# EAGLE schematic Adapter (EAGLE 6.4)

## Sheet 1 of 8
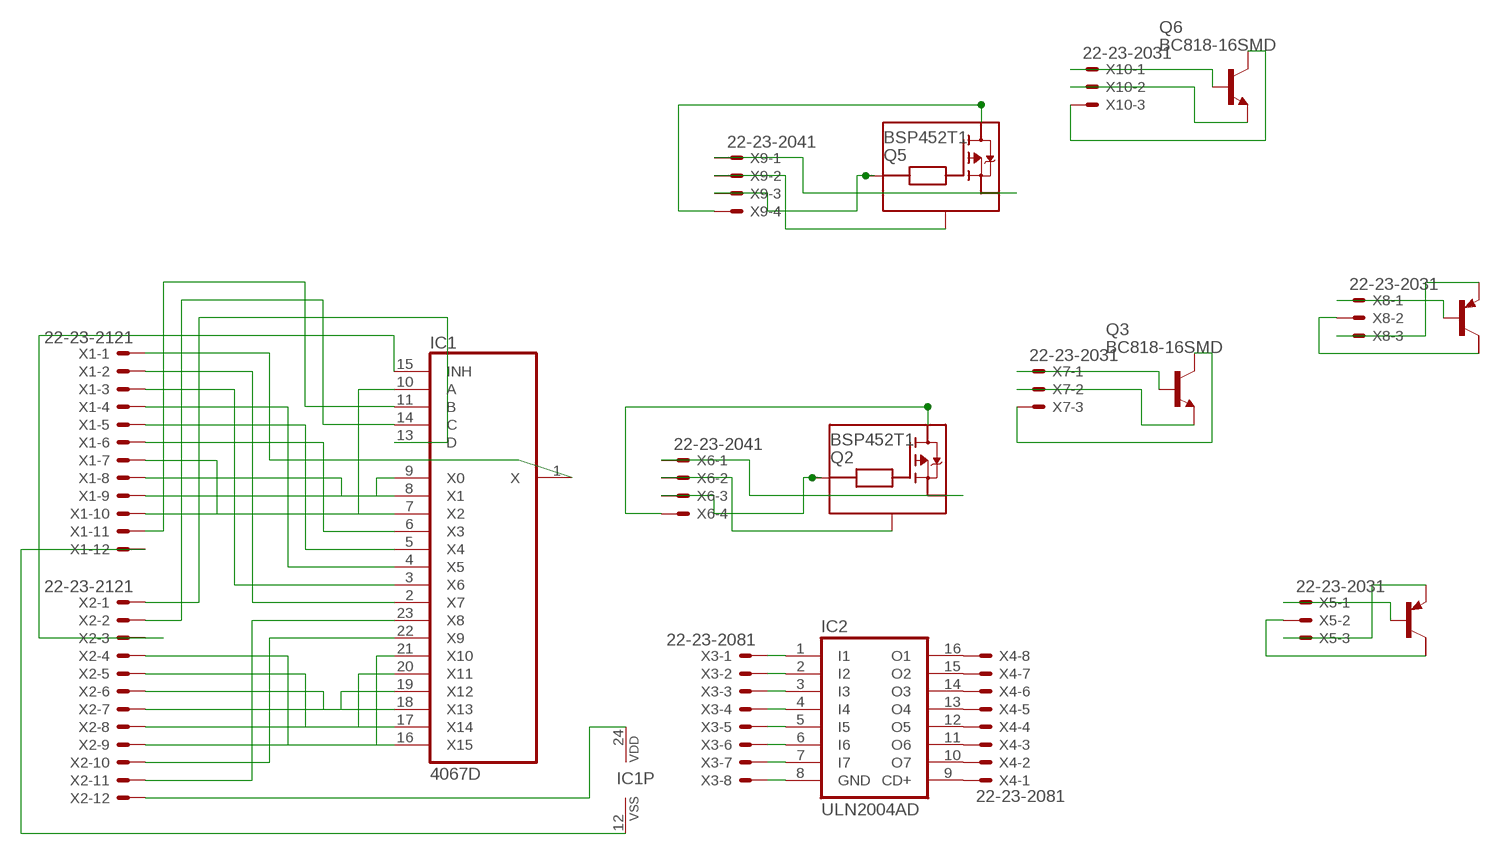
[diagram p0: schematic, sheet 1]

### Parts
IC1  4067D  [SO24W]
IC2  ULN2004AD  [SO16]
Q1  BCP53T1  [SOT223]
Q2  BSP452T1  [SOT223]
Q3  BC818-16SMD  [SOT23-BEC]
Q4  BCP53T1  [SOT223]
Q5  BSP452T1  [SOT223]
Q6  BC818-16SMD  [SOT23-BEC]
X1  22-23-2121  [22-23-2121]
X2  22-23-2121  [22-23-2121]
X3  22-23-2081  [22-23-2081]
X4  22-23-2081  [22-23-2081]
X5  22-23-2031  [22-23-2031]
X6  22-23-2041  [22-23-2041]
X7  22-23-2031  [22-23-2031]
X8  22-23-2031  [22-23-2031]
X9  22-23-2041  [22-23-2041]
X10  22-23-2031  [22-23-2031]

### Nets
N$1: IC1.2(X7) X1.2
N$2: IC1.1(X) X1.1
N$3: IC1.3(X6) X1.3
N$4: IC1.4(X5) X1.4
N$5: IC1.5(X4) X1.5
N$6: IC1.6(X3) X1.6
N$7: IC1.7(X2) X1.7
N$8: IC1.8(X1) X1.8
N$9: IC1.9(X0) X1.9
N$10: IC1.10(A) X1.10
N$11: IC1.11(B) X1.11
N$12: IC1.16(X15) X2.4
N$13: IC1.17(X14) X2.5
N$14: IC1.18(X13) X2.6
N$15: IC1.19(X12) X2.7
N$16: IC1.20(X11) X2.8
N$17: IC1.21(X10) X2.9
N$18: IC1.22(X9) X2.10
N$19: IC1.23(X8) X2.11
N$20: IC1.12(VSS) X1.12
N$21: IC1.24(VDD) X2.12
N$22: IC1.15(INH) X2.3
N$23: IC1.14(C) X2.2
N$24: IC1.13(D) X2.1
N$25: IC2.1(I1) X3.1
N$26: IC2.2(I2) X3.2
N$27: IC2.3(I3) X3.3
N$28: IC2.4(I4) X3.4
N$29: IC2.5(I5) X3.5
N$30: IC2.6(I6) X3.6
N$31: IC2.7(I7) X3.7
N$32: IC2.8(GND) X3.8
N$33: IC2.9(CD+) X4.1
N$34: IC2.10(O7) X4.2
N$35: IC2.11(O6) X4.3
N$36: IC2.12(O5) X4.4
N$37: IC2.13(O4) X4.5
N$38: IC2.14(O3) X4.6
N$39: IC2.15(O2) X4.7
N$40: IC2.16(O1) X4.8
N$41: Q1.1(B) X5.1
N$42: Q1.3(E) X5.3
N$43: Q1.2(C) X5.2
N$44: Q2.1(OUT) X6.1
N$45: Q2.2(GND) X6.2
N$46: Q2.3(IN) X6.3
N$47: Q2.4(V+) X6.4
N$48: Q3.B X7.1
N$49: Q3.E X7.2
N$50: Q3.C X7.3
N$51: Q4.1(B) X8.1
N$52: Q4.2(C) X8.2
N$53: Q4.3(E) X8.3
N$54: Q5.1(OUT) X9.1
N$55: Q5.2(GND) X9.2
N$56: Q5.3(IN) X9.3
N$57: Q5.4(V+) X9.4
N$58: Q6.B X10.1
N$59: Q6.E X10.2
N$60: Q6.C X10.3
Unconnected: Q1.4(C/) Q4.4(C/)

## Sheet 2 of 8
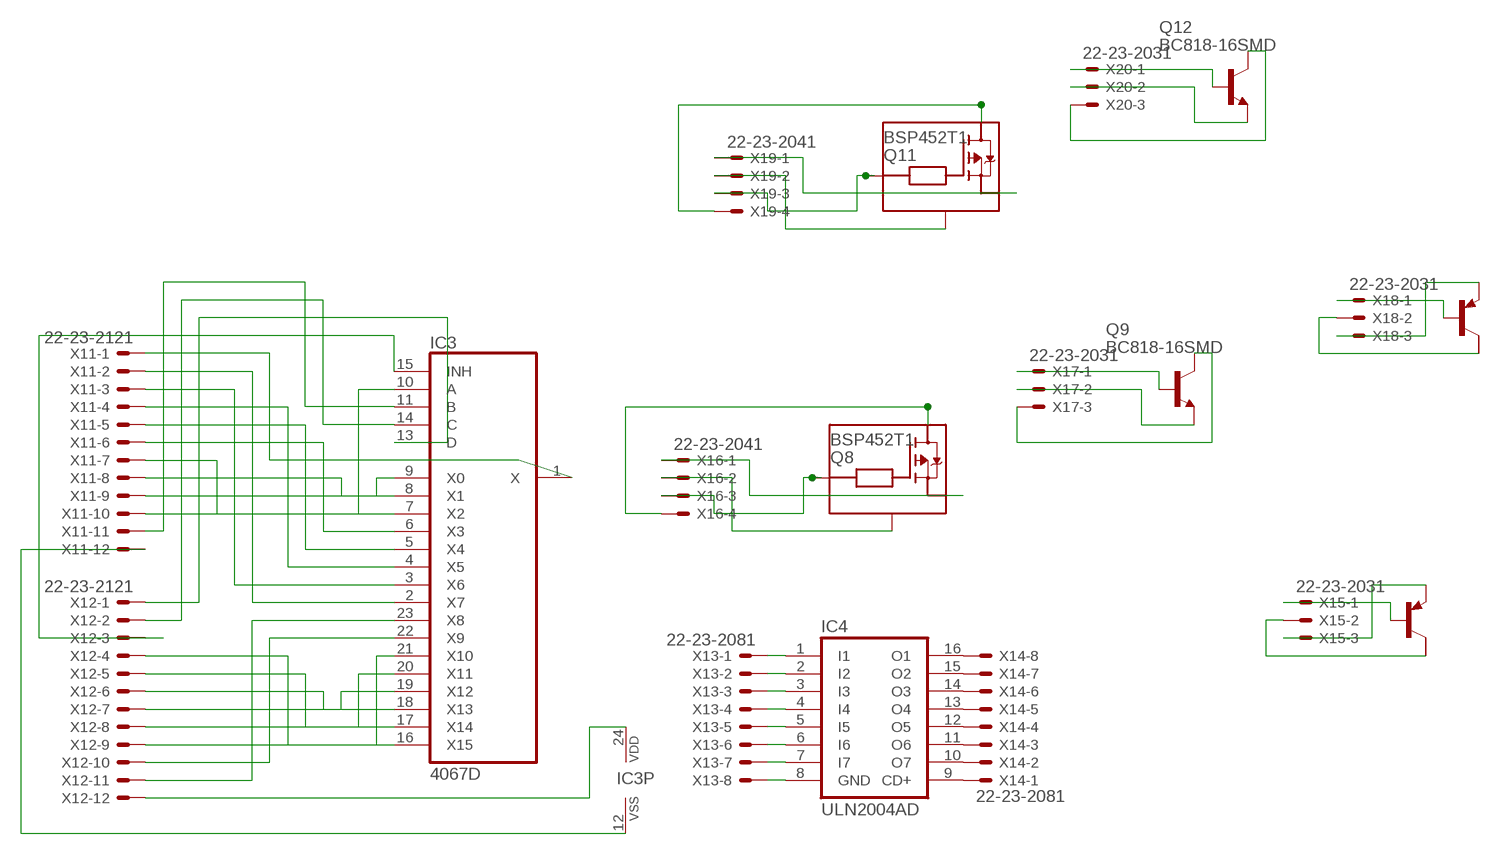
[diagram p1: schematic, sheet 2]

### Parts
IC3  4067D  [SO24W]
IC4  ULN2004AD  [SO16]
Q7  BCP53T1  [SOT223]
Q8  BSP452T1  [SOT223]
Q9  BC818-16SMD  [SOT23-BEC]
Q10  BCP53T1  [SOT223]
Q11  BSP452T1  [SOT223]
Q12  BC818-16SMD  [SOT23-BEC]
X11  22-23-2121  [22-23-2121]
X12  22-23-2121  [22-23-2121]
X13  22-23-2081  [22-23-2081]
X14  22-23-2081  [22-23-2081]
X15  22-23-2031  [22-23-2031]
X16  22-23-2041  [22-23-2041]
X17  22-23-2031  [22-23-2031]
X18  22-23-2031  [22-23-2031]
X19  22-23-2041  [22-23-2041]
X20  22-23-2031  [22-23-2031]

### Nets
N$63: IC3.2(X7) X11.2
N$64: IC3.1(X) X11.1
N$65: IC3.3(X6) X11.3
N$66: IC3.4(X5) X11.4
N$67: IC3.5(X4) X11.5
N$68: IC3.6(X3) X11.6
N$69: IC3.7(X2) X11.7
N$70: IC3.8(X1) X11.8
N$71: IC3.9(X0) X11.9
N$72: IC3.10(A) X11.10
N$73: IC3.11(B) X11.11
N$74: IC3.16(X15) X12.4
N$75: IC3.17(X14) X12.5
N$76: IC3.18(X13) X12.6
N$77: IC3.19(X12) X12.7
N$78: IC3.20(X11) X12.8
N$79: IC3.21(X10) X12.9
N$80: IC3.22(X9) X12.10
N$81: IC3.23(X8) X12.11
N$82: IC3.12(VSS) X11.12
N$83: IC3.24(VDD) X12.12
N$84: IC3.15(INH) X12.3
N$85: IC3.14(C) X12.2
N$86: IC3.13(D) X12.1
N$87: IC4.1(I1) X13.1
N$88: IC4.2(I2) X13.2
N$89: IC4.3(I3) X13.3
N$90: IC4.4(I4) X13.4
N$91: IC4.5(I5) X13.5
N$92: IC4.6(I6) X13.6
N$93: IC4.7(I7) X13.7
N$94: IC4.8(GND) X13.8
N$95: IC4.9(CD+) X14.1
N$96: IC4.10(O7) X14.2
N$97: IC4.11(O6) X14.3
N$98: IC4.12(O5) X14.4
N$99: IC4.13(O4) X14.5
N$100: IC4.14(O3) X14.6
N$101: IC4.15(O2) X14.7
N$102: IC4.16(O1) X14.8
N$103: Q7.1(B) X15.1
N$104: Q7.2(C) X15.2
N$105: Q7.3(E) X15.3
N$106: Q8.1(OUT) X16.1
N$107: Q8.2(GND) X16.2
N$108: Q8.3(IN) X16.3
N$109: Q8.4(V+) X16.4
N$110: Q9.B X17.1
N$111: Q9.E X17.2
N$112: Q9.C X17.3
N$113: Q10.1(B) X18.1
N$114: Q10.2(C) X18.2
N$115: Q10.3(E) X18.3
N$116: Q11.1(OUT) X19.1
N$117: Q11.2(GND) X19.2
N$118: Q11.3(IN) X19.3
N$119: Q11.4(V+) X19.4
N$120: Q12.B X20.1
N$121: Q12.E X20.2
N$122: Q12.C X20.3
Unconnected: Q7.4(C/) Q10.4(C/)

## Sheet 3 of 8
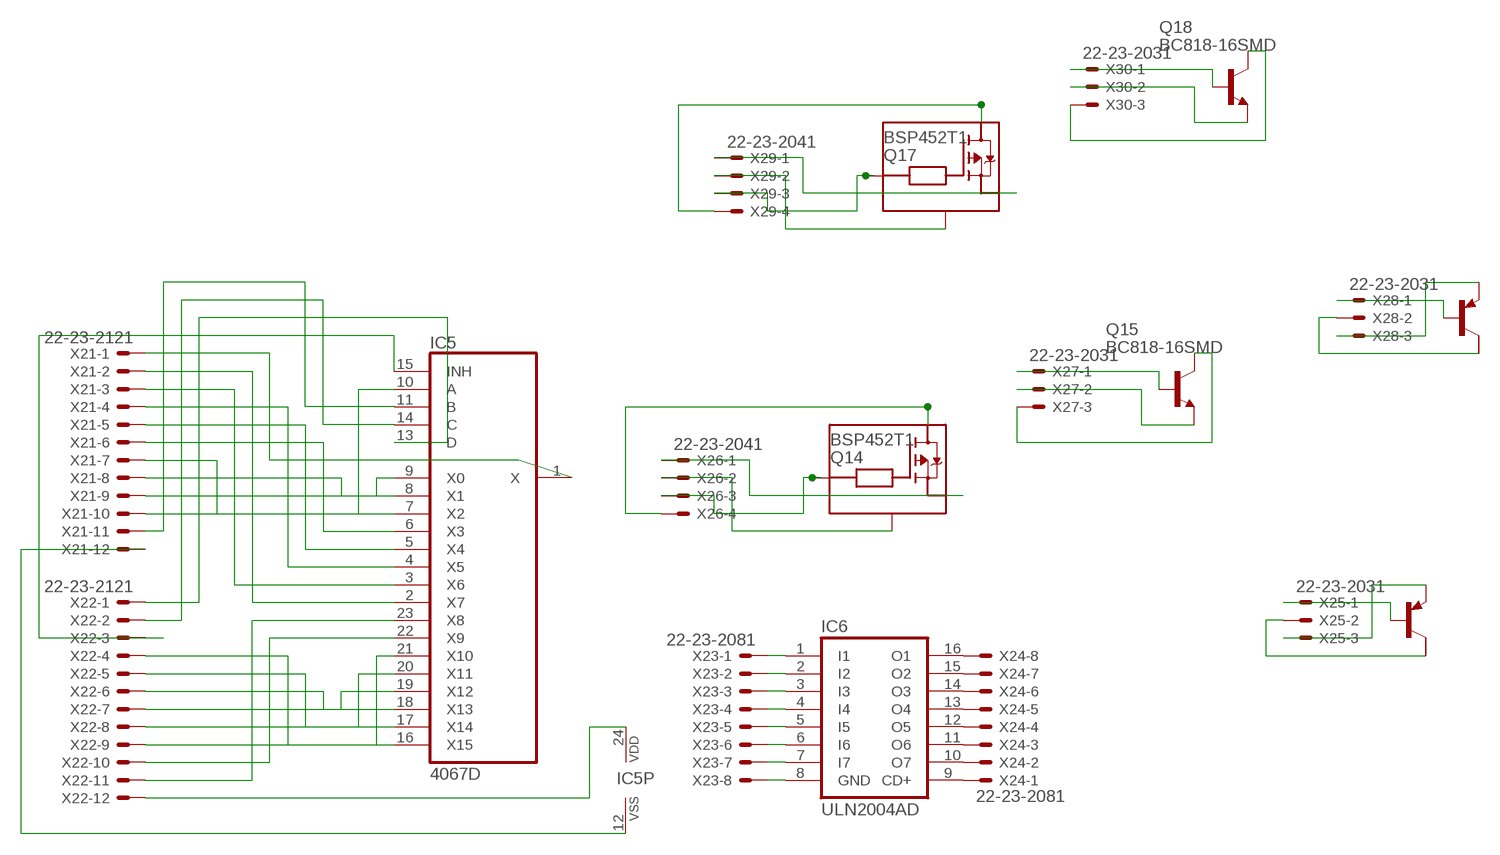
[diagram p2: schematic, sheet 3]

### Parts
IC5  4067D  [SO24W]
IC6  ULN2004AD  [SO16]
Q13  BCP53T1  [SOT223]
Q14  BSP452T1  [SOT223]
Q15  BC818-16SMD  [SOT23-BEC]
Q16  BCP53T1  [SOT223]
Q17  BSP452T1  [SOT223]
Q18  BC818-16SMD  [SOT23-BEC]
X21  22-23-2121  [22-23-2121]
X22  22-23-2121  [22-23-2121]
X23  22-23-2081  [22-23-2081]
X24  22-23-2081  [22-23-2081]
X25  22-23-2031  [22-23-2031]
X26  22-23-2041  [22-23-2041]
X27  22-23-2031  [22-23-2031]
X28  22-23-2031  [22-23-2031]
X29  22-23-2041  [22-23-2041]
X30  22-23-2031  [22-23-2031]

### Nets
N$125: IC5.2(X7) X21.2
N$126: IC5.1(X) X21.1
N$127: IC5.3(X6) X21.3
N$128: IC5.4(X5) X21.4
N$129: IC5.5(X4) X21.5
N$130: IC5.6(X3) X21.6
N$131: IC5.7(X2) X21.7
N$132: IC5.8(X1) X21.8
N$133: IC5.9(X0) X21.9
N$134: IC5.10(A) X21.10
N$135: IC5.11(B) X21.11
N$136: IC5.16(X15) X22.4
N$137: IC5.17(X14) X22.5
N$138: IC5.18(X13) X22.6
N$139: IC5.19(X12) X22.7
N$140: IC5.20(X11) X22.8
N$141: IC5.21(X10) X22.9
N$142: IC5.22(X9) X22.10
N$143: IC5.23(X8) X22.11
N$144: IC5.12(VSS) X21.12
N$145: IC5.24(VDD) X22.12
N$146: IC5.15(INH) X22.3
N$147: IC5.14(C) X22.2
N$148: IC5.13(D) X22.1
N$149: IC6.1(I1) X23.1
N$150: IC6.2(I2) X23.2
N$151: IC6.3(I3) X23.3
N$152: IC6.4(I4) X23.4
N$153: IC6.5(I5) X23.5
N$154: IC6.6(I6) X23.6
N$155: IC6.7(I7) X23.7
N$156: IC6.8(GND) X23.8
N$157: IC6.9(CD+) X24.1
N$158: IC6.10(O7) X24.2
N$159: IC6.11(O6) X24.3
N$160: IC6.12(O5) X24.4
N$161: IC6.13(O4) X24.5
N$162: IC6.14(O3) X24.6
N$163: IC6.15(O2) X24.7
N$164: IC6.16(O1) X24.8
N$165: Q13.1(B) X25.1
N$166: Q13.2(C) X25.2
N$167: Q13.3(E) X25.3
N$168: Q14.1(OUT) X26.1
N$169: Q14.2(GND) X26.2
N$170: Q14.3(IN) X26.3
N$171: Q14.4(V+) X26.4
N$172: Q15.B X27.1
N$173: Q15.E X27.2
N$174: Q15.C X27.3
N$175: Q16.1(B) X28.1
N$176: Q16.2(C) X28.2
N$177: Q16.3(E) X28.3
N$178: Q17.1(OUT) X29.1
N$179: Q17.2(GND) X29.2
N$180: Q17.3(IN) X29.3
N$181: Q17.4(V+) X29.4
N$182: Q18.B X30.1
N$183: Q18.E X30.2
N$184: Q18.C X30.3
Unconnected: Q13.4(C/) Q16.4(C/)

## Sheet 4 of 8
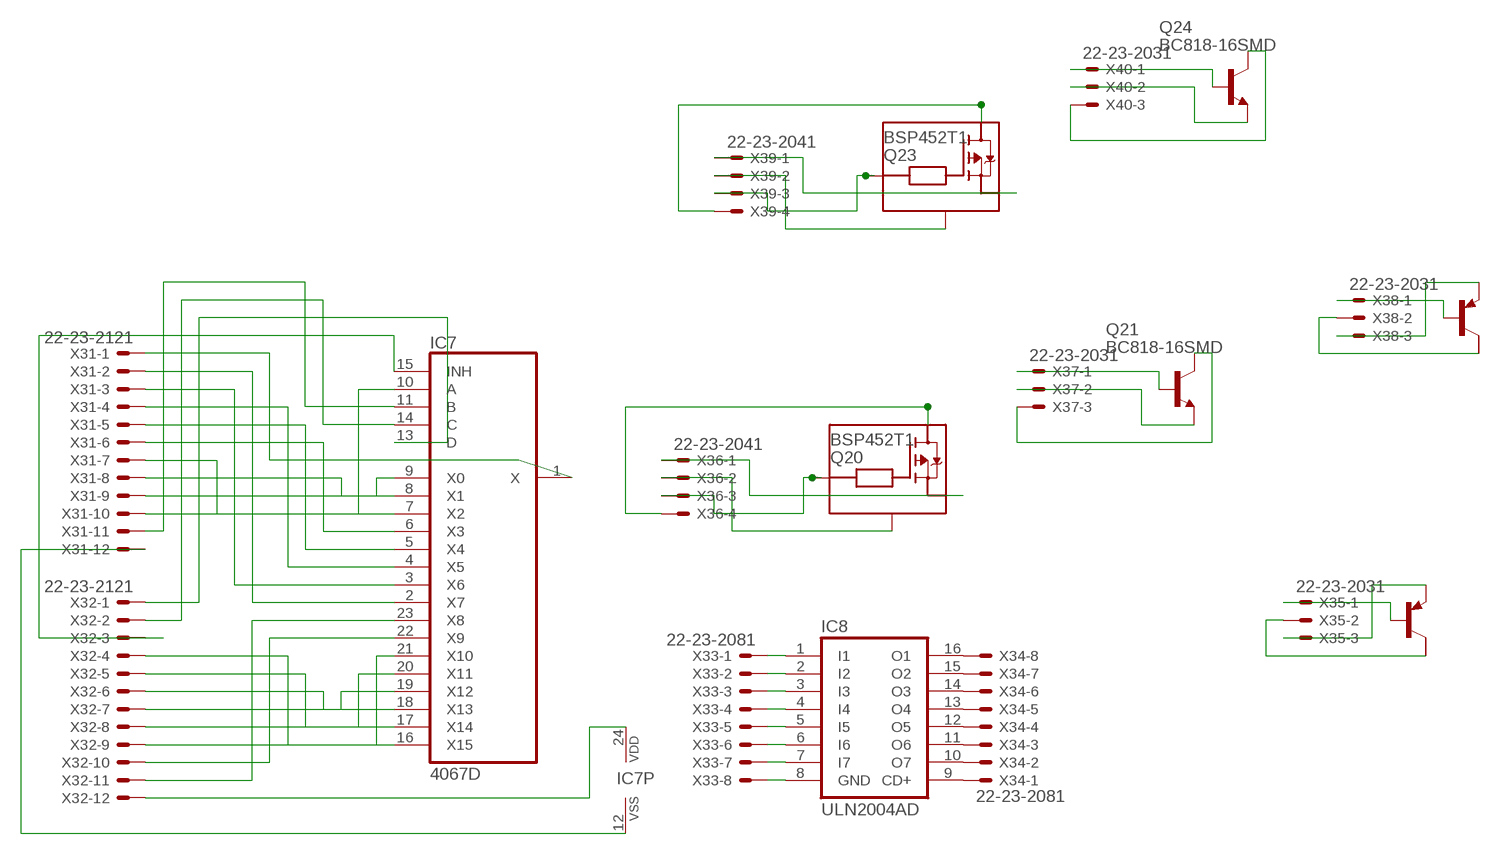
[diagram p3: schematic, sheet 4]

### Parts
IC7  4067D  [SO24W]
IC8  ULN2004AD  [SO16]
Q19  BCP53T1  [SOT223]
Q20  BSP452T1  [SOT223]
Q21  BC818-16SMD  [SOT23-BEC]
Q22  BCP53T1  [SOT223]
Q23  BSP452T1  [SOT223]
Q24  BC818-16SMD  [SOT23-BEC]
X31  22-23-2121  [22-23-2121]
X32  22-23-2121  [22-23-2121]
X33  22-23-2081  [22-23-2081]
X34  22-23-2081  [22-23-2081]
X35  22-23-2031  [22-23-2031]
X36  22-23-2041  [22-23-2041]
X37  22-23-2031  [22-23-2031]
X38  22-23-2031  [22-23-2031]
X39  22-23-2041  [22-23-2041]
X40  22-23-2031  [22-23-2031]

### Nets
N$185: IC7.2(X7) X31.2
N$186: IC7.1(X) X31.1
N$187: IC7.3(X6) X31.3
N$188: IC7.4(X5) X31.4
N$189: IC7.5(X4) X31.5
N$190: IC7.6(X3) X31.6
N$191: IC7.7(X2) X31.7
N$192: IC7.8(X1) X31.8
N$193: IC7.9(X0) X31.9
N$194: IC7.10(A) X31.10
N$195: IC7.11(B) X31.11
N$196: IC7.16(X15) X32.4
N$197: IC7.17(X14) X32.5
N$198: IC7.18(X13) X32.6
N$199: IC7.19(X12) X32.7
N$200: IC7.20(X11) X32.8
N$201: IC7.21(X10) X32.9
N$202: IC7.22(X9) X32.10
N$203: IC7.23(X8) X32.11
N$204: IC7.12(VSS) X31.12
N$205: IC7.24(VDD) X32.12
N$206: IC7.15(INH) X32.3
N$207: IC7.14(C) X32.2
N$208: IC7.13(D) X32.1
N$209: IC8.1(I1) X33.1
N$210: IC8.2(I2) X33.2
N$211: IC8.3(I3) X33.3
N$212: IC8.4(I4) X33.4
N$213: IC8.5(I5) X33.5
N$214: IC8.6(I6) X33.6
N$215: IC8.7(I7) X33.7
N$216: IC8.8(GND) X33.8
N$217: IC8.9(CD+) X34.1
N$218: IC8.10(O7) X34.2
N$219: IC8.11(O6) X34.3
N$220: IC8.12(O5) X34.4
N$221: IC8.13(O4) X34.5
N$222: IC8.14(O3) X34.6
N$223: IC8.15(O2) X34.7
N$224: IC8.16(O1) X34.8
N$225: Q19.1(B) X35.1
N$226: Q19.2(C) X35.2
N$227: Q19.3(E) X35.3
N$228: Q20.1(OUT) X36.1
N$229: Q20.2(GND) X36.2
N$230: Q20.3(IN) X36.3
N$231: Q20.4(V+) X36.4
N$232: Q21.B X37.1
N$233: Q21.E X37.2
N$234: Q21.C X37.3
N$235: Q22.1(B) X38.1
N$236: Q22.2(C) X38.2
N$237: Q22.3(E) X38.3
N$238: Q23.1(OUT) X39.1
N$239: Q23.2(GND) X39.2
N$240: Q23.3(IN) X39.3
N$241: Q23.4(V+) X39.4
N$242: Q24.B X40.1
N$243: Q24.E X40.2
N$244: Q24.C X40.3
Unconnected: Q19.4(C/) Q22.4(C/)

## Sheet 5 of 8
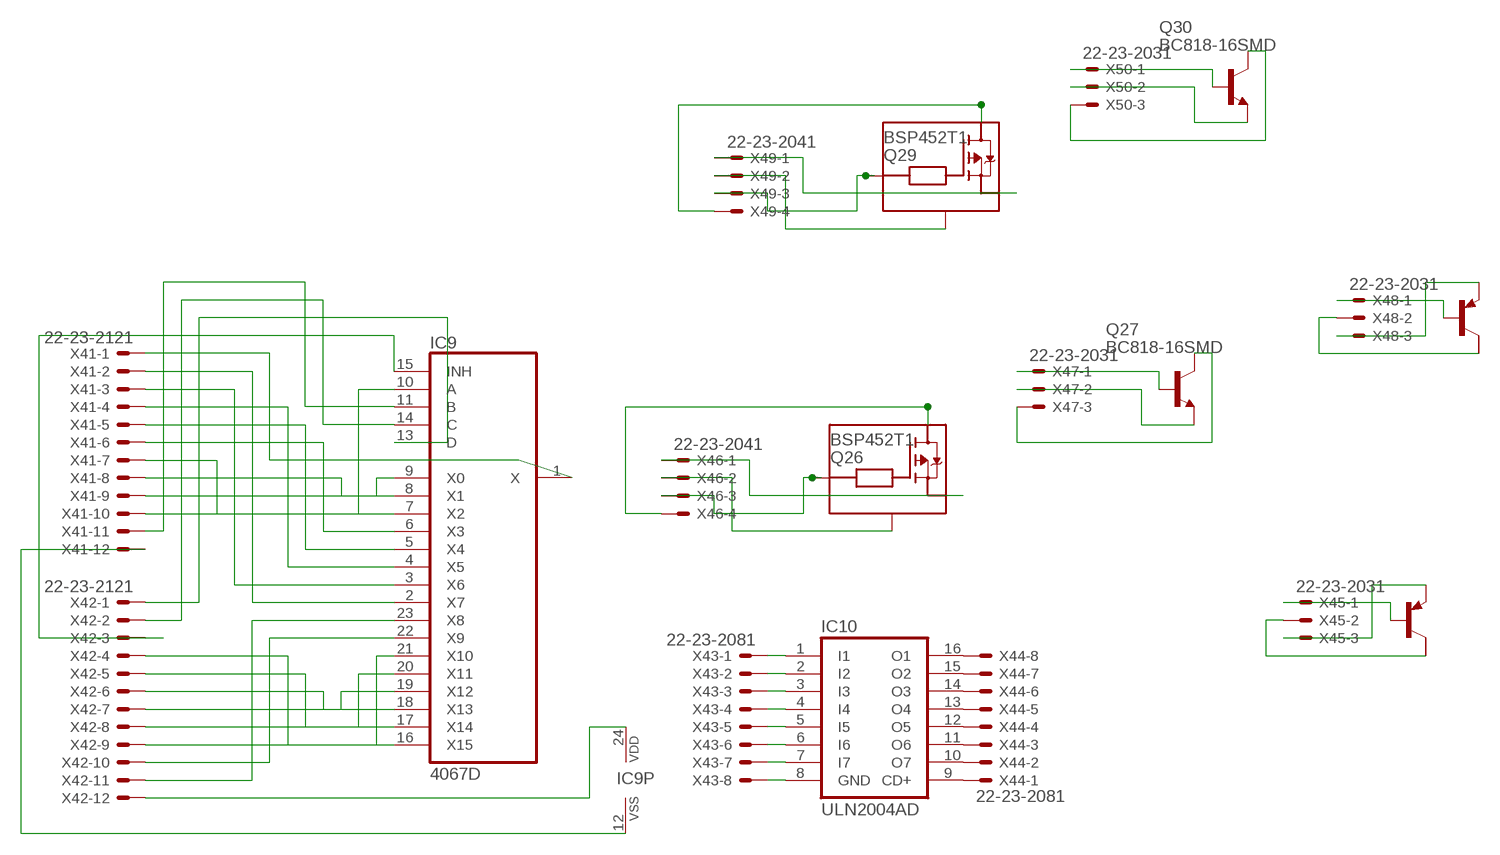
[diagram p4: schematic, sheet 5]

### Parts
IC9  4067D  [SO24W]
IC10  ULN2004AD  [SO16]
Q25  BCP53T1  [SOT223]
Q26  BSP452T1  [SOT223]
Q27  BC818-16SMD  [SOT23-BEC]
Q28  BCP53T1  [SOT223]
Q29  BSP452T1  [SOT223]
Q30  BC818-16SMD  [SOT23-BEC]
X41  22-23-2121  [22-23-2121]
X42  22-23-2121  [22-23-2121]
X43  22-23-2081  [22-23-2081]
X44  22-23-2081  [22-23-2081]
X45  22-23-2031  [22-23-2031]
X46  22-23-2041  [22-23-2041]
X47  22-23-2031  [22-23-2031]
X48  22-23-2031  [22-23-2031]
X49  22-23-2041  [22-23-2041]
X50  22-23-2031  [22-23-2031]

### Nets
N$249: IC9.2(X7) X41.2
N$250: IC9.1(X) X41.1
N$251: IC9.3(X6) X41.3
N$252: IC9.4(X5) X41.4
N$253: IC9.5(X4) X41.5
N$254: IC9.6(X3) X41.6
N$255: IC9.7(X2) X41.7
N$256: IC9.8(X1) X41.8
N$257: IC9.9(X0) X41.9
N$258: IC9.10(A) X41.10
N$259: IC9.11(B) X41.11
N$260: IC9.16(X15) X42.4
N$261: IC9.17(X14) X42.5
N$262: IC9.18(X13) X42.6
N$263: IC9.19(X12) X42.7
N$264: IC9.20(X11) X42.8
N$265: IC9.21(X10) X42.9
N$266: IC9.22(X9) X42.10
N$267: IC9.23(X8) X42.11
N$268: IC9.12(VSS) X41.12
N$269: IC9.24(VDD) X42.12
N$270: IC9.15(INH) X42.3
N$271: IC9.14(C) X42.2
N$272: IC9.13(D) X42.1
N$273: IC10.1(I1) X43.1
N$274: IC10.2(I2) X43.2
N$275: IC10.3(I3) X43.3
N$276: IC10.4(I4) X43.4
N$277: IC10.5(I5) X43.5
N$278: IC10.6(I6) X43.6
N$279: IC10.7(I7) X43.7
N$280: IC10.8(GND) X43.8
N$281: IC10.9(CD+) X44.1
N$282: IC10.10(O7) X44.2
N$283: IC10.11(O6) X44.3
N$284: IC10.12(O5) X44.4
N$285: IC10.13(O4) X44.5
N$286: IC10.14(O3) X44.6
N$287: IC10.15(O2) X44.7
N$288: IC10.16(O1) X44.8
N$289: Q25.1(B) X45.1
N$290: Q25.2(C) X45.2
N$291: Q25.3(E) X45.3
N$292: Q26.1(OUT) X46.1
N$293: Q26.2(GND) X46.2
N$294: Q26.3(IN) X46.3
N$295: Q26.4(V+) X46.4
N$296: Q27.B X47.1
N$297: Q27.E X47.2
N$298: Q27.C X47.3
N$299: Q28.1(B) X48.1
N$300: Q28.2(C) X48.2
N$301: Q28.3(E) X48.3
N$302: Q29.1(OUT) X49.1
N$303: Q29.2(GND) X49.2
N$304: Q29.3(IN) X49.3
N$305: Q29.4(V+) X49.4
N$306: Q30.B X50.1
N$307: Q30.E X50.2
N$308: Q30.C X50.3
Unconnected: Q25.4(C/) Q28.4(C/)

## Sheet 6 of 8
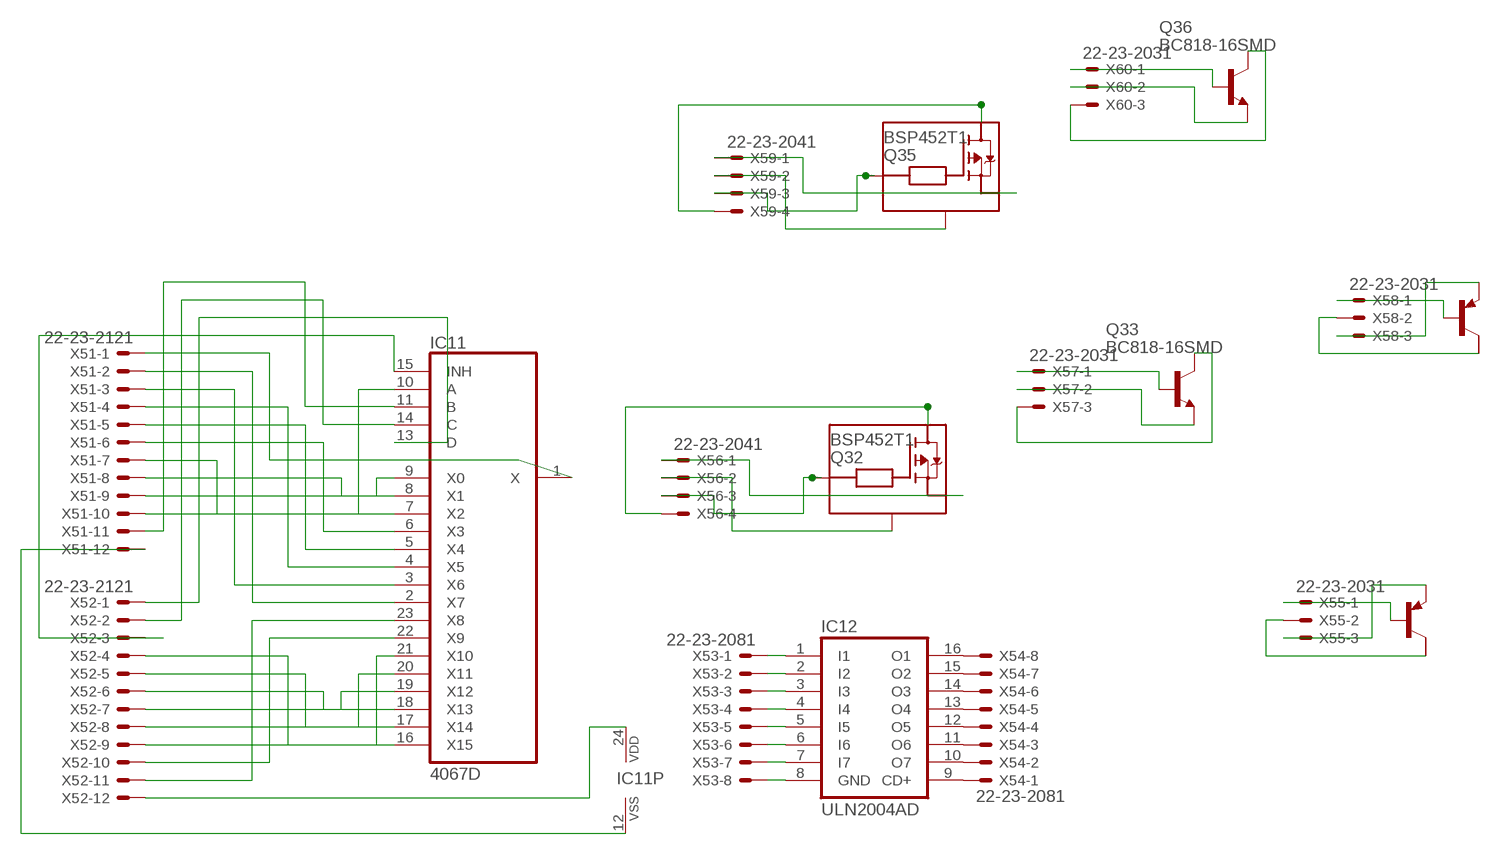
[diagram p5: schematic, sheet 6]

### Parts
IC11  4067D  [SO24W]
IC12  ULN2004AD  [SO16]
Q31  BCP53T1  [SOT223]
Q32  BSP452T1  [SOT223]
Q33  BC818-16SMD  [SOT23-BEC]
Q34  BCP53T1  [SOT223]
Q35  BSP452T1  [SOT223]
Q36  BC818-16SMD  [SOT23-BEC]
X51  22-23-2121  [22-23-2121]
X52  22-23-2121  [22-23-2121]
X53  22-23-2081  [22-23-2081]
X54  22-23-2081  [22-23-2081]
X55  22-23-2031  [22-23-2031]
X56  22-23-2041  [22-23-2041]
X57  22-23-2031  [22-23-2031]
X58  22-23-2031  [22-23-2031]
X59  22-23-2041  [22-23-2041]
X60  22-23-2031  [22-23-2031]

### Nets
N$309: IC11.2(X7) X51.2
N$310: IC11.1(X) X51.1
N$311: IC11.3(X6) X51.3
N$312: IC11.4(X5) X51.4
N$313: IC11.5(X4) X51.5
N$314: IC11.6(X3) X51.6
N$315: IC11.7(X2) X51.7
N$316: IC11.8(X1) X51.8
N$317: IC11.9(X0) X51.9
N$318: IC11.10(A) X51.10
N$319: IC11.11(B) X51.11
N$320: IC11.16(X15) X52.4
N$321: IC11.17(X14) X52.5
N$322: IC11.18(X13) X52.6
N$323: IC11.19(X12) X52.7
N$324: IC11.20(X11) X52.8
N$325: IC11.21(X10) X52.9
N$326: IC11.22(X9) X52.10
N$327: IC11.23(X8) X52.11
N$328: IC11.12(VSS) X51.12
N$329: IC11.24(VDD) X52.12
N$330: IC11.15(INH) X52.3
N$331: IC11.14(C) X52.2
N$332: IC11.13(D) X52.1
N$333: IC12.1(I1) X53.1
N$334: IC12.2(I2) X53.2
N$335: IC12.3(I3) X53.3
N$336: IC12.4(I4) X53.4
N$337: IC12.5(I5) X53.5
N$338: IC12.6(I6) X53.6
N$339: IC12.7(I7) X53.7
N$340: IC12.8(GND) X53.8
N$341: IC12.9(CD+) X54.1
N$342: IC12.10(O7) X54.2
N$343: IC12.11(O6) X54.3
N$344: IC12.12(O5) X54.4
N$345: IC12.13(O4) X54.5
N$346: IC12.14(O3) X54.6
N$347: IC12.15(O2) X54.7
N$348: IC12.16(O1) X54.8
N$349: Q31.1(B) X55.1
N$350: Q31.2(C) X55.2
N$351: Q31.3(E) X55.3
N$352: Q32.1(OUT) X56.1
N$353: Q32.2(GND) X56.2
N$354: Q32.3(IN) X56.3
N$355: Q32.4(V+) X56.4
N$356: Q33.B X57.1
N$357: Q33.E X57.2
N$358: Q33.C X57.3
N$359: Q34.1(B) X58.1
N$360: Q34.2(C) X58.2
N$361: Q34.3(E) X58.3
N$362: Q35.1(OUT) X59.1
N$363: Q35.2(GND) X59.2
N$364: Q35.3(IN) X59.3
N$365: Q35.4(V+) X59.4
N$366: Q36.B X60.1
N$367: Q36.E X60.2
N$368: Q36.C X60.3
Unconnected: Q31.4(C/) Q34.4(C/)

## Sheet 7 of 8
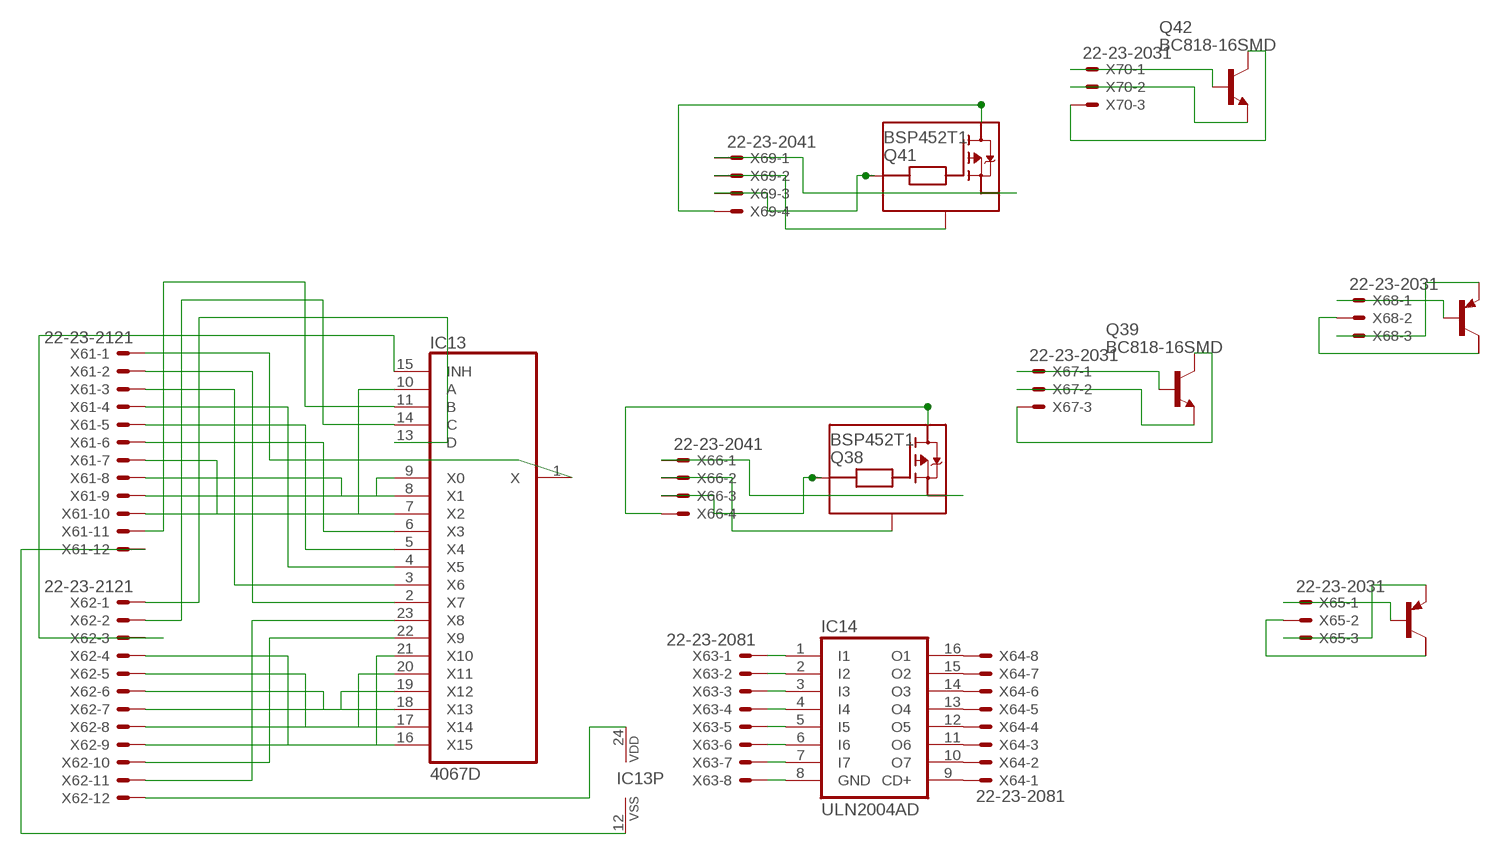
[diagram p6: schematic, sheet 7]

### Parts
IC13  4067D  [SO24W]
IC14  ULN2004AD  [SO16]
Q37  BCP53T1  [SOT223]
Q38  BSP452T1  [SOT223]
Q39  BC818-16SMD  [SOT23-BEC]
Q40  BCP53T1  [SOT223]
Q41  BSP452T1  [SOT223]
Q42  BC818-16SMD  [SOT23-BEC]
X61  22-23-2121  [22-23-2121]
X62  22-23-2121  [22-23-2121]
X63  22-23-2081  [22-23-2081]
X64  22-23-2081  [22-23-2081]
X65  22-23-2031  [22-23-2031]
X66  22-23-2041  [22-23-2041]
X67  22-23-2031  [22-23-2031]
X68  22-23-2031  [22-23-2031]
X69  22-23-2041  [22-23-2041]
X70  22-23-2031  [22-23-2031]

### Nets
N$369: IC13.2(X7) X61.2
N$370: IC13.1(X) X61.1
N$371: IC13.3(X6) X61.3
N$372: IC13.4(X5) X61.4
N$373: IC13.5(X4) X61.5
N$374: IC13.6(X3) X61.6
N$375: IC13.7(X2) X61.7
N$376: IC13.8(X1) X61.8
N$377: IC13.9(X0) X61.9
N$378: IC13.10(A) X61.10
N$379: IC13.11(B) X61.11
N$380: IC13.16(X15) X62.4
N$381: IC13.17(X14) X62.5
N$382: IC13.18(X13) X62.6
N$383: IC13.19(X12) X62.7
N$384: IC13.20(X11) X62.8
N$385: IC13.21(X10) X62.9
N$386: IC13.22(X9) X62.10
N$387: IC13.23(X8) X62.11
N$388: IC13.12(VSS) X61.12
N$389: IC13.24(VDD) X62.12
N$390: IC13.15(INH) X62.3
N$391: IC13.14(C) X62.2
N$392: IC13.13(D) X62.1
N$393: IC14.1(I1) X63.1
N$394: IC14.2(I2) X63.2
N$395: IC14.3(I3) X63.3
N$396: IC14.4(I4) X63.4
N$397: IC14.5(I5) X63.5
N$398: IC14.6(I6) X63.6
N$399: IC14.7(I7) X63.7
N$400: IC14.8(GND) X63.8
N$401: IC14.9(CD+) X64.1
N$402: IC14.10(O7) X64.2
N$403: IC14.11(O6) X64.3
N$404: IC14.12(O5) X64.4
N$405: IC14.13(O4) X64.5
N$406: IC14.14(O3) X64.6
N$407: IC14.15(O2) X64.7
N$408: IC14.16(O1) X64.8
N$409: Q37.1(B) X65.1
N$410: Q37.2(C) X65.2
N$411: Q37.3(E) X65.3
N$412: Q38.1(OUT) X66.1
N$413: Q38.2(GND) X66.2
N$414: Q38.3(IN) X66.3
N$415: Q38.4(V+) X66.4
N$416: Q39.B X67.1
N$417: Q39.E X67.2
N$418: Q39.C X67.3
N$419: Q40.1(B) X68.1
N$420: Q40.2(C) X68.2
N$421: Q40.3(E) X68.3
N$422: Q41.1(OUT) X69.1
N$423: Q41.2(GND) X69.2
N$424: Q41.3(IN) X69.3
N$425: Q41.4(V+) X69.4
N$426: Q42.B X70.1
N$427: Q42.E X70.2
N$428: Q42.C X70.3
Unconnected: Q37.4(C/) Q40.4(C/)

## Sheet 8 of 8
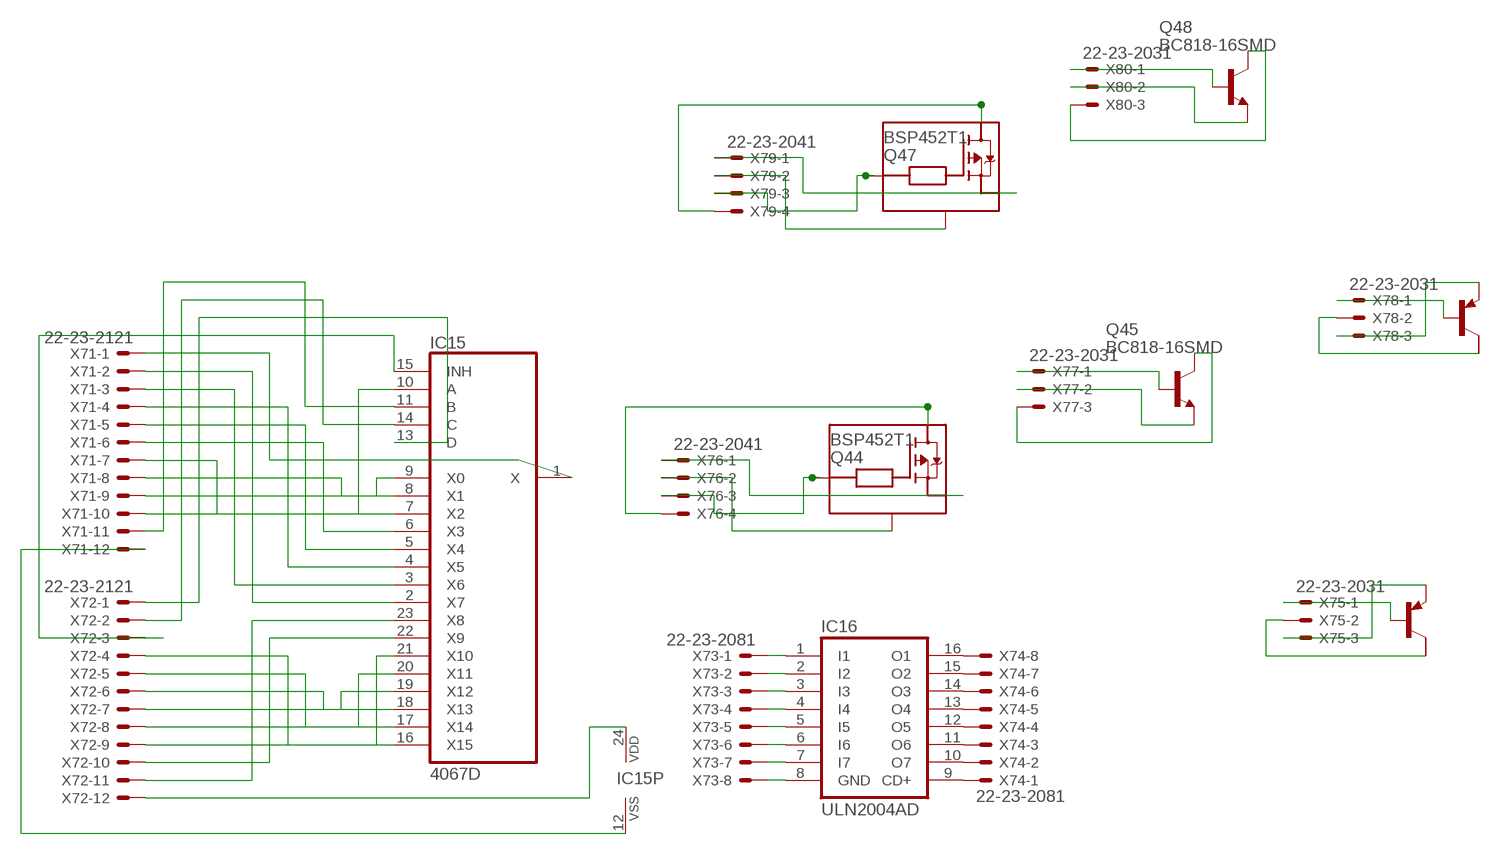
[diagram p7: schematic, sheet 8]

### Parts
IC15  4067D  [SO24W]
IC16  ULN2004AD  [SO16]
Q43  BCP53T1  [SOT223]
Q44  BSP452T1  [SOT223]
Q45  BC818-16SMD  [SOT23-BEC]
Q46  BCP53T1  [SOT223]
Q47  BSP452T1  [SOT223]
Q48  BC818-16SMD  [SOT23-BEC]
X71  22-23-2121  [22-23-2121]
X72  22-23-2121  [22-23-2121]
X73  22-23-2081  [22-23-2081]
X74  22-23-2081  [22-23-2081]
X75  22-23-2031  [22-23-2031]
X76  22-23-2041  [22-23-2041]
X77  22-23-2031  [22-23-2031]
X78  22-23-2031  [22-23-2031]
X79  22-23-2041  [22-23-2041]
X80  22-23-2031  [22-23-2031]

### Nets
N$429: IC15.2(X7) X71.2
N$430: IC15.1(X) X71.1
N$431: IC15.3(X6) X71.3
N$432: IC15.4(X5) X71.4
N$433: IC15.5(X4) X71.5
N$434: IC15.6(X3) X71.6
N$435: IC15.7(X2) X71.7
N$436: IC15.8(X1) X71.8
N$437: IC15.9(X0) X71.9
N$438: IC15.10(A) X71.10
N$439: IC15.11(B) X71.11
N$440: IC15.16(X15) X72.4
N$441: IC15.17(X14) X72.5
N$442: IC15.18(X13) X72.6
N$443: IC15.19(X12) X72.7
N$444: IC15.20(X11) X72.8
N$445: IC15.21(X10) X72.9
N$446: IC15.22(X9) X72.10
N$447: IC15.23(X8) X72.11
N$448: IC15.12(VSS) X71.12
N$449: IC15.24(VDD) X72.12
N$450: IC15.15(INH) X72.3
N$451: IC15.14(C) X72.2
N$452: IC15.13(D) X72.1
N$453: IC16.1(I1) X73.1
N$454: IC16.2(I2) X73.2
N$455: IC16.3(I3) X73.3
N$456: IC16.4(I4) X73.4
N$457: IC16.5(I5) X73.5
N$458: IC16.6(I6) X73.6
N$459: IC16.7(I7) X73.7
N$460: IC16.8(GND) X73.8
N$461: IC16.9(CD+) X74.1
N$462: IC16.10(O7) X74.2
N$463: IC16.11(O6) X74.3
N$464: IC16.12(O5) X74.4
N$465: IC16.13(O4) X74.5
N$466: IC16.14(O3) X74.6
N$467: IC16.15(O2) X74.7
N$468: IC16.16(O1) X74.8
N$469: Q43.1(B) X75.1
N$470: Q43.2(C) X75.2
N$471: Q43.3(E) X75.3
N$472: Q44.1(OUT) X76.1
N$473: Q44.2(GND) X76.2
N$474: Q44.3(IN) X76.3
N$475: Q44.4(V+) X76.4
N$476: Q45.B X77.1
N$477: Q45.E X77.2
N$478: Q45.C X77.3
N$479: Q46.1(B) X78.1
N$480: Q46.2(C) X78.2
N$481: Q46.3(E) X78.3
N$482: Q47.1(OUT) X79.1
N$483: Q47.2(GND) X79.2
N$484: Q47.3(IN) X79.3
N$485: Q47.4(V+) X79.4
N$486: Q48.B X80.1
N$487: Q48.E X80.2
N$488: Q48.C X80.3
Unconnected: Q43.4(C/) Q46.4(C/)

## Library data of the parts
IC1 IC3 IC5 IC7 IC9 IC11 IC13 IC15 = 40xx:4067: 16-channel ANALOG MULTIPLEXER
IC2 IC4 IC6 IC8 IC10 IC12 IC14 IC16 = uln-udn:ULN2004A: DRIVER ARRAY
Q1 Q4 Q7 Q10 Q13 Q16 Q19 Q22 Q25 Q28 Q31 Q34 Q37 Q40 Q43 Q46 = BCP53_:BCP53*
Q2 Q5 Q8 Q11 Q14 Q17 Q20 Q23 Q26 Q29 Q32 Q35 Q38 Q41 Q44 Q47 = BSP452:BSP452
Q3 Q6 Q9 Q12 Q15 Q18 Q21 Q24 Q27 Q30 Q33 Q36 Q39 Q42 Q45 Q48 = transistor-npn:BC818*: NPN Transistor
X1 X2 X11 X12 X21 X22 X31 X32 X41 X42 X51 X52 X61 X62 X71 X72 = con-molex:22-23-2121: .100" (2.54mm) Center Header - 12 Pin; MF: MOLEX; MPN: 22-23-2121; OC_FARNELL: 1462935; OC_NEWARK: 56H0456
X3 X4 X13 X14 X23 X24 X33 X34 X43 X44 X53 X54 X63 X64 X73 X74 = con-molex:22-23-2081: .100" (2.54mm) Center Header - 8 Pin; MF: MOLEX; MPN: 22-23-2081; OC_FARNELL: 1756826; OC_NEWARK: 01C7592
X5 X7 X8 X10 X15 X17 X18 X20 X25 X27 X28 X30 X35 X37 X38 X40 X45 X47 X48 X50 X55 X57 X58 X60 X65 X67 X68 X70 X75 X77 X78 X80 = con-molex:22-23-2031: .100" (2.54mm) Center Header - 3 Pin; MF: MOLEX; MPN: 22-23-2031; OC_FARNELL: 1462950; OC_NEWARK: 30C0862
X6 X9 X16 X19 X26 X29 X36 X39 X46 X49 X56 X59 X66 X69 X76 X79 = con-molex:22-23-2041: .100" (2.54mm) Center Header - 4 Pin; MF: MOLEX; MPN: 22-23-2041; OC_FARNELL: 1462920; OC_NEWARK: 38C0355